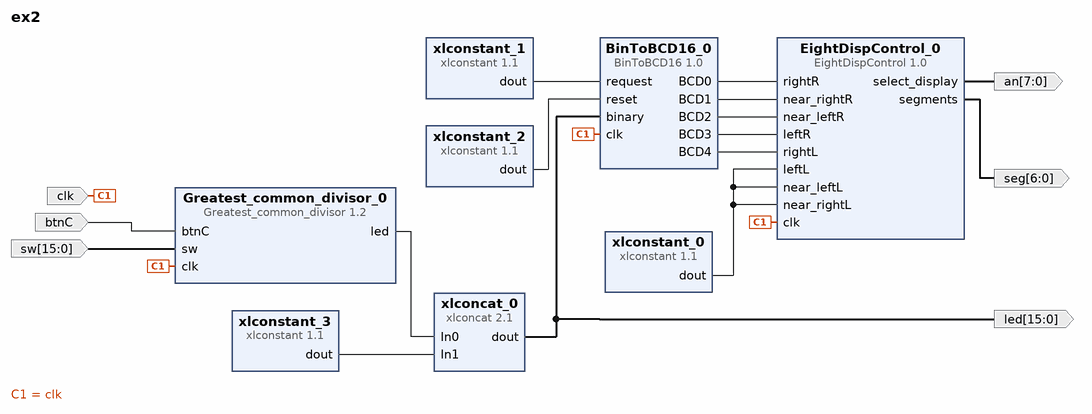
[diagram p0: block diagram of the top level]
# Vivado block design ex2, xc7a100tcsg324-3, Vivado 2016.4
create_bd_design ex2

create_bd_port -dir I clk
create_bd_port -dir O -from 6 -to 0 seg
create_bd_port -dir O -from 7 -to 0 an
create_bd_port -dir O -from 15 -to 0 led
create_bd_port -dir I btnC
create_bd_port -dir I -from 15 -to 0 sw

create_bd_cell -type ip -vlnv ua.pt:user:BinToBCD16:1.0 BinToBCD16_0
create_bd_cell -type ip -vlnv xilinx.com:ip:xlconstant:1.1 xlconstant_0
set_property -dict {CONFIG.CONST_WIDTH 4 CONFIG.CONST_VAL 0} [get_bd_cells xlconstant_0]
create_bd_cell -type ip -vlnv xilinx.com:ip:xlconstant:1.1 xlconstant_1
set_property -dict {CONFIG.CONST_VAL 1} [get_bd_cells xlconstant_1]
create_bd_cell -type ip -vlnv ua.pt:user:EightDispControl:1.0 EightDispControl_0
create_bd_cell -type ip -vlnv xilinx.com:ip:xlconstant:1.1 xlconstant_2
set_property -dict {CONFIG.CONST_VAL 0} [get_bd_cells xlconstant_2]
create_bd_cell -type ip -vlnv xilinx.com:ip:xlconcat:2.1 xlconcat_0
set_property -dict {CONFIG.IN0_WIDTH 8 CONFIG.IN1_WIDTH 8} [get_bd_cells xlconcat_0]
create_bd_cell -type ip -vlnv xilinx.com:ip:xlconstant:1.1 xlconstant_3
set_property -dict {CONFIG.CONST_WIDTH 8 CONFIG.CONST_VAL 0} [get_bd_cells xlconstant_3]
create_bd_cell -type ip -vlnv ua.pt:user:Greatest_common_divisor:1.2 Greatest_common_divisor_0

# ---- connections ----

connect_bd_net [get_bd_ports clk] [get_bd_pins BinToBCD16_0/clk] [get_bd_pins EightDispControl_0/clk] [get_bd_pins Greatest_common_divisor_0/clk]
connect_bd_net [get_bd_pins xlconstant_1/dout] [get_bd_pins BinToBCD16_0/request]
connect_bd_net [get_bd_pins BinToBCD16_0/BCD0] [get_bd_pins EightDispControl_0/rightR]
connect_bd_net [get_bd_pins BinToBCD16_0/BCD1] [get_bd_pins EightDispControl_0/near_rightR]
connect_bd_net [get_bd_pins BinToBCD16_0/BCD2] [get_bd_pins EightDispControl_0/near_leftR]
connect_bd_net [get_bd_pins BinToBCD16_0/BCD3] [get_bd_pins EightDispControl_0/leftR]
connect_bd_net [get_bd_pins BinToBCD16_0/BCD4] [get_bd_pins EightDispControl_0/rightL]
connect_bd_net [get_bd_pins EightDispControl_0/segments] [get_bd_ports seg]
connect_bd_net [get_bd_pins EightDispControl_0/select_display] [get_bd_ports an]
connect_bd_net [get_bd_pins xlconstant_0/dout] \
  [get_bd_pins EightDispControl_0/near_rightL] [get_bd_pins EightDispControl_0/near_leftL] \
  [get_bd_pins EightDispControl_0/leftL]
connect_bd_net [get_bd_pins xlconstant_2/dout] [get_bd_pins BinToBCD16_0/reset]
connect_bd_net [get_bd_pins xlconcat_0/dout] [get_bd_ports led] [get_bd_pins BinToBCD16_0/binary]
connect_bd_net [get_bd_pins xlconstant_3/dout] [get_bd_pins xlconcat_0/In1]
connect_bd_net [get_bd_ports btnC] [get_bd_pins Greatest_common_divisor_0/btnC]
connect_bd_net [get_bd_ports sw] [get_bd_pins Greatest_common_divisor_0/sw]
connect_bd_net [get_bd_pins Greatest_common_divisor_0/led] [get_bd_pins xlconcat_0/In0]

validate_bd_design
save_bd_design
